# EAGLE design rrsdc (EAGLE 6.4)
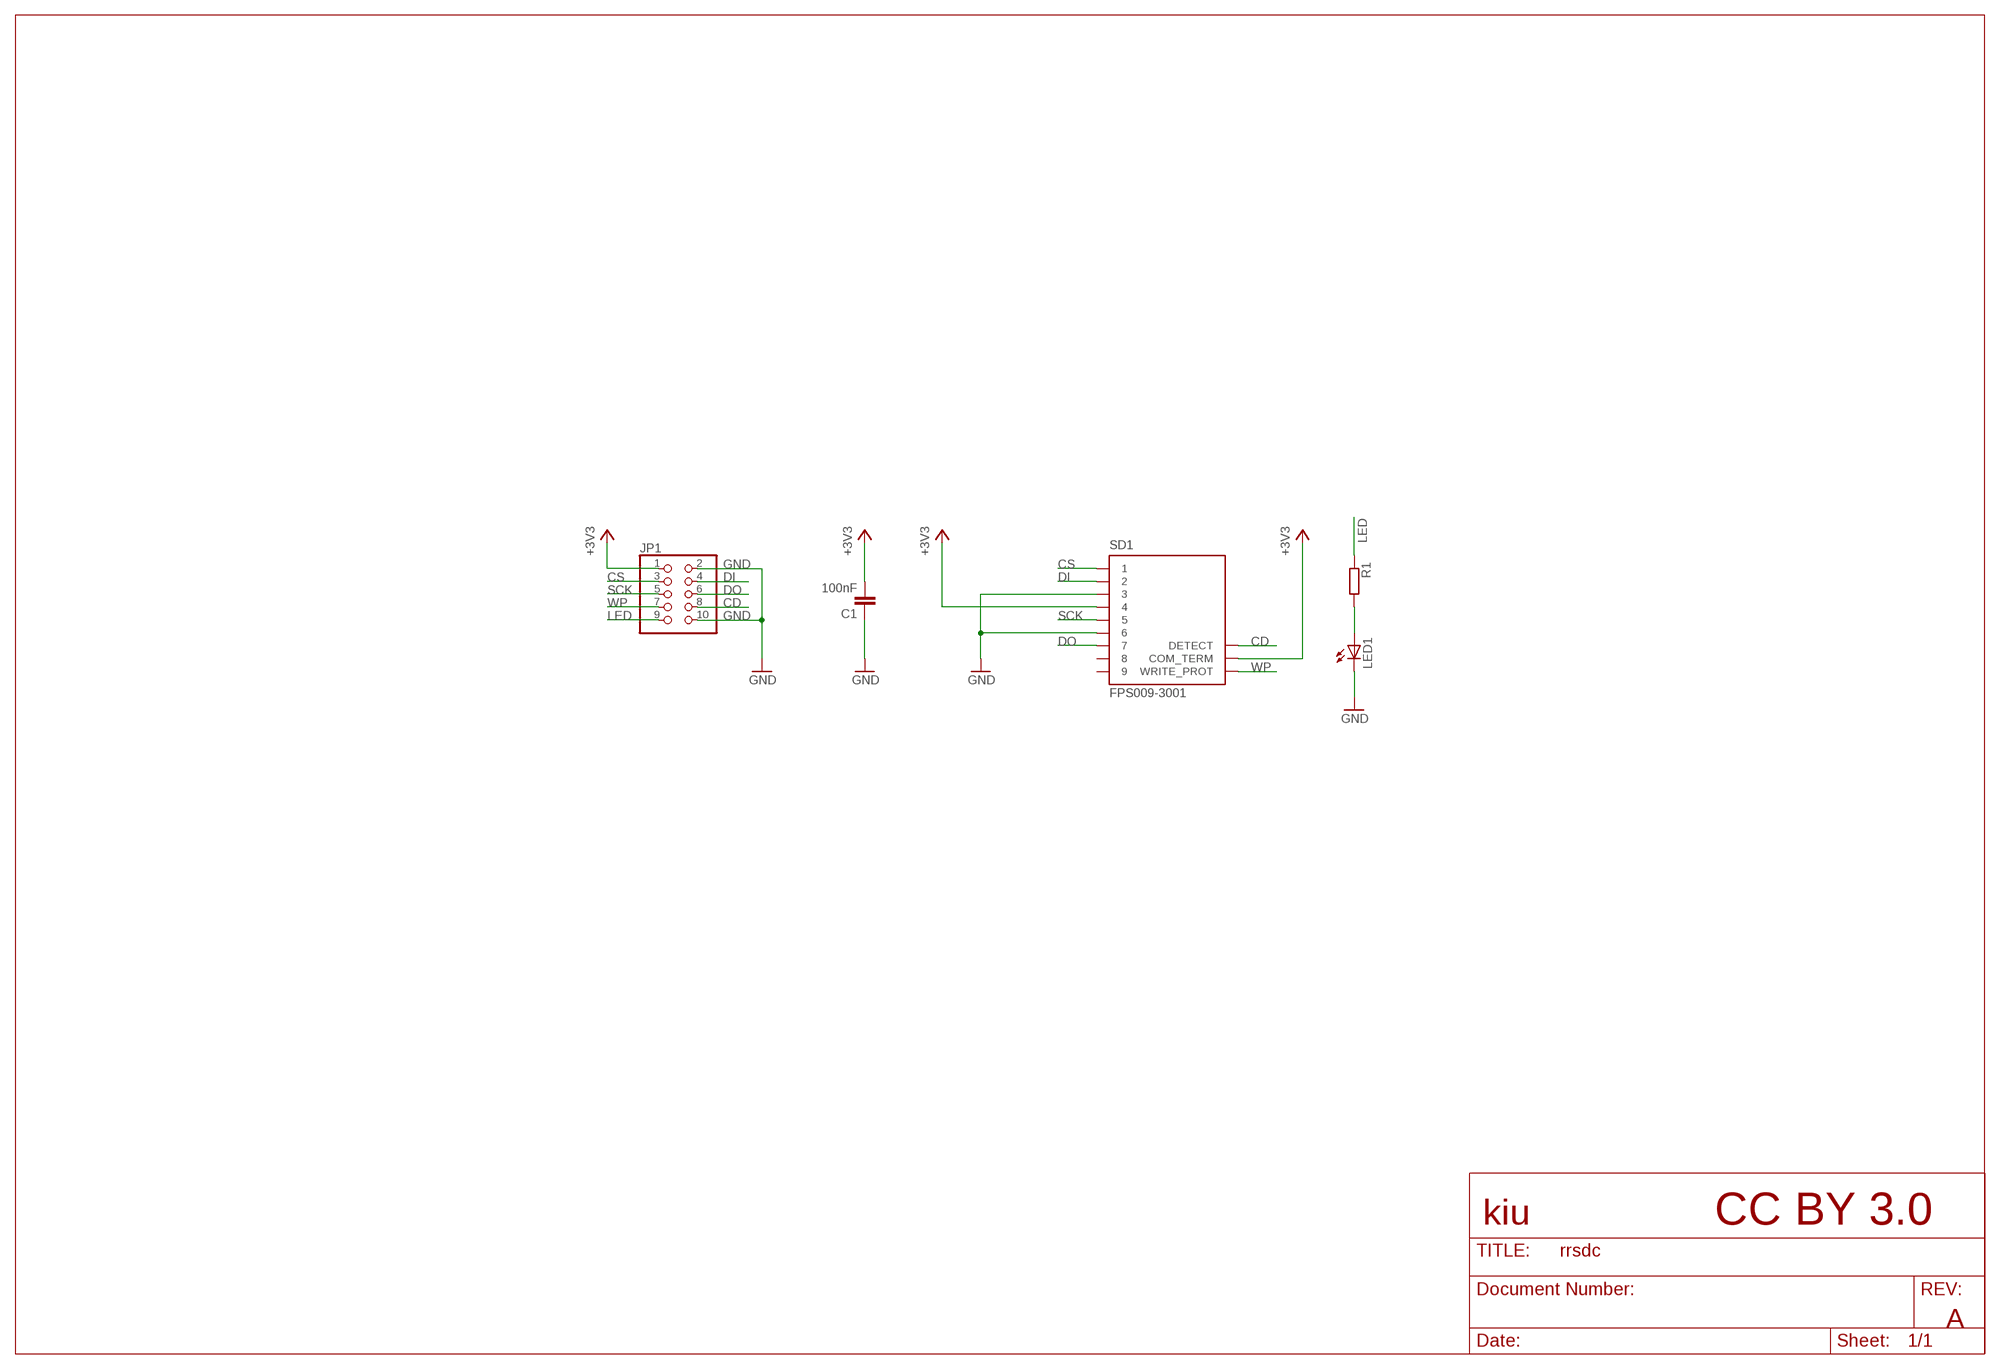
[diagram p0: schematic, sheet 1]

## Parts
C1  100nF  C-EUC0805  [C0805]
JP1  PINHD-2X5  [2X05]
LED1  SIDELEDPLCC-NOTHERM  [PLCC-2-NOTHERM]
R1  R-EU_R0805  [R0805]
SD1  FPS009-3001  [FPS009-3000]

## Nets
+3V3: C1.2 JP1.1 SD1.4 SD1.COM_TERM
CD: JP1.8 SD1.DETECT
CS: JP1.3 SD1.1
DI: JP1.4 SD1.2
DO: JP1.6 SD1.7
GND: C1.1 JP1.2 JP1.10 LED1.C SD1.3 SD1.6
LED: JP1.9 R1.1
N$2: LED1.A R1.2
SCK: JP1.5 SD1.5
WP: JP1.7 SD1.WRITE_PROT
Unconnected: SD1.8 SD1.9

## Notes on the sheet
- kiu | CC BY 3.0
- A

## Library data of the parts
C1 = rcl:C-EU: CAPACITOR, European symbol
JP1 = pinhead:PINHD-2X5: PIN HEADER
LED1 = kiu:SIDELED: Special SIDELED (DO NOT USE)
R1 = rcl:R-EU_: RESISTOR, European symbol
SD1 = con-yamaichi:FPS009-300*: SD Card and MMC Reader (Manual Insertion) Source: http://www.yamaichi.de/pdf/c_fps009_3000.pdf; MPN: FPS009-3001-BL; OC_FARNELL: 1143952; OC_NEWARK: 91K9875

## Board
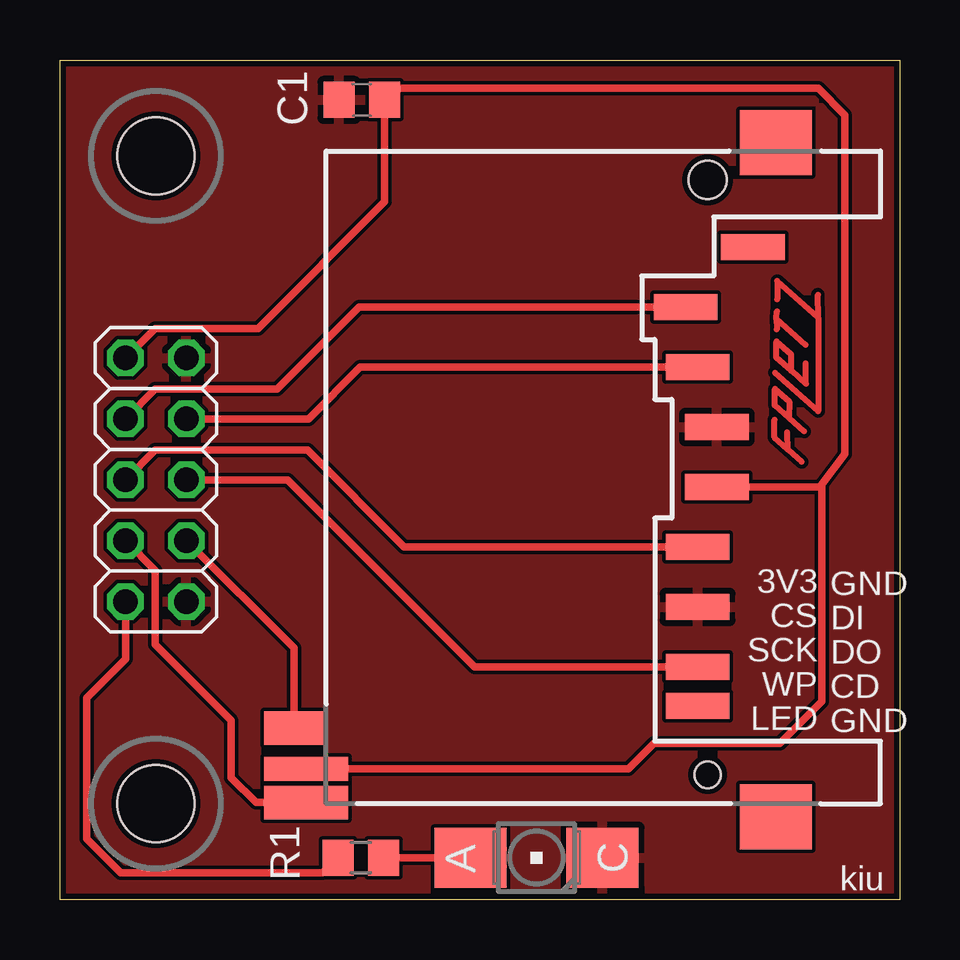
[diagram p1: board, top side]
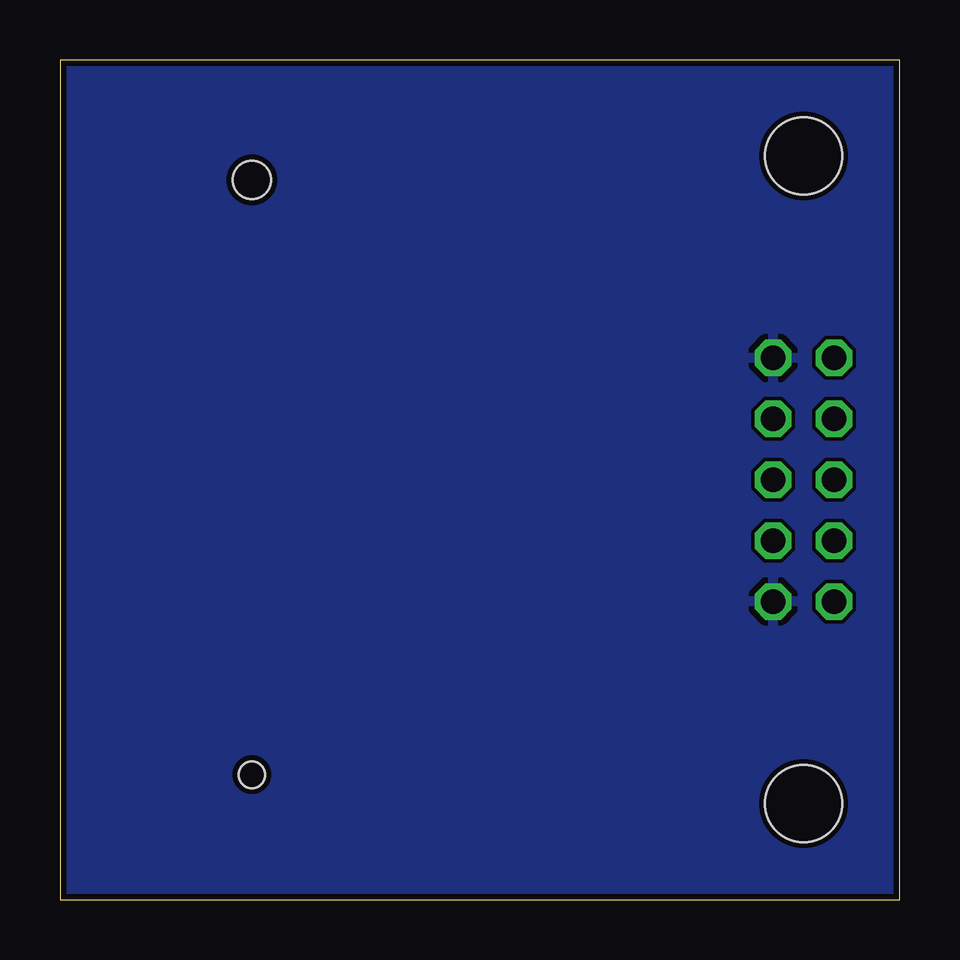
[diagram p2: board, bottom side, seen from below]

Size 35 x 35 mm. Coordinates in mm from the lower left corner, seen from the top.
Outline: 0,0 0,35 35,35 35,0 0,0
Copper layers (1*2*15*16): Top 0.035mm / dielectric 0.2mm / layer 2 0.0175mm / dielectric 1.1mm / layer 15 0.0175mm / dielectric 0.2mm / Bottom 0.035mm
Design rules "SeeedStudio_DRU_no_angle_20130527": minimum track width 6mil, minimum drill 12mil, track to track 6mil, track to pad 6mil, pad to pad 6mil, via to via 6mil, smd to smd 0mil, copper to edge 10mil, drill to drill 10mil, minimum pad ring 6mil, minimum via ring 6mil, stop-mask expansion 2mil, vias tented up to drill 25mil, thermal gap 10mil
Holes 3.2 mm at 4,31 4,4

### Footprints (pad centres in the part's own frame; a part is rotated, then mirrored left to right if it is on the bottom)
C0805 = smd 1.3 x 1.5: 1 -0.95,0; 2 0.95,0
2X05 = drill 1.016 octagon: 1 -5.08,-1.27; 2 -5.08,1.27; 3 -2.54,-1.27; 4 -2.54,1.27; 5 0,-1.27; 6 0,1.27; 7 2.54,-1.27; 8 2.54,1.27; 9 5.08,-1.27; 10 5.08,1.27
PLCC-2-NOTHERM = smd 2.5 x 3: A 0,2.75; C 0,-2.75
R0805 = smd 1.3 x 1.5: 1 -0.95,0; 2 0.95,0
FPS009-3000 = smd 2.65 x 1.1: 1 -0.915,-5.3; 2 -0.415,-7.8; 3 0.385,-10.3; 4 0.385,-12.8; 5 -0.415,-15.3; 6 -0.415,-17.8; 7 -0.415,-20.3; 8 -0.415,-21.925; 9 1.885,-2.8 | smd 3.5 x 1: COM_TERM -16.75,-24.55 | smd 2.5 x 1.4: DETECT -17.25,-22.85 | smd 3 x 2.7: M1 2.85,1.55; M2 2.85,-26.55 | smd 3.5 x 1.4: WRITE_PROT -16.75,-25.95 | hole 1.6: 0,0 | hole 1.1: 0,-24.8

### Placement (x,y rotation side)
C1  12.58,33.33 0 top
JP1  4,17.5 270 top
LED1  19.87,1.75 90 top
R1  12.54,1.75 0 top
SD1  27,30 0 top

### Tracks (layer width: path | path; a pad name or v marks a point on that pad's centre or on a via)
+3V3
  Top 0.305: JP1.1 3.96,23.81 8.26,23.81 13.53,29.09 C1.2 14.17,33.81 31.61,33.81 32.73,32.7 32.73,18.57 31.73,17.28 | SD1.4 31.67,17.2 31.73,17.28 | 31.73,17.28 31.75,17.26 31.75,8.26 30,6.51 24.77,6.51 23.71,5.45 SD1.COM_TERM
CD
  Top 0.305: JP1.8 9.75,10.48 SD1.DETECT
CS
  Top 0.305: JP1.3 3.96,21.27 9.05,21.27 12.48,24.7 SD1.1
DI
  Top 0.305: SD1.2 12.52,22.2 10.36,20.04 JP1.4
DO
  Top 0.305: SD1.7 17.29,9.7 9.49,17.5 JP1.6
GND
  pour Top: -0.5,35.5 35.5,35.5 35.5,-0.5 -0.5,-0.5
  pour Bottom: -0.5,35.5 35.5,35.5 35.5,-0.5 -0.5,-0.5
LED
  Top 0.305: JP1.9 2.73,10.03 1.11,8.41 1.11,2.54 2.54,1.11 10.96,1.11 R1.1
N$2
  Top 0.305: R1.2 LED1.A
N$28
  Top 0.254: 30.41,20.06 29.8,20.61 29.8,21.29 30.42,20.74 30.41,20.06 | 31.03,19.51 30.41,20.06
N$29
  Top 0.254: 29.81,21.96 31.61,20.36 31.61,24.27 | 29.9,25.03 29.9,25.79 31.61,24.27 | 31.61,24.27 31.6,25.21
N$30
  Top 0.254: 31.09,22.35 31.1,21.5 30.48,22.05 | 30.48,22.05 29.86,22.59 29.87,23.27 30.48,22.72 30.48,22.05
N$31
  Top 0.254: 29.79,20 29.79,19.26 30.35,18.75 | 30.35,18.75 30.92,18.25 | 30.35,18.75 30.31,19.47
N$32
  Top 0.254: 29.86,24.21 29.89,23.77 | 31.09,23.12 29.86,24.21 | 29.86,24.21 29.89,24.53
SCK
  Top 0.305: JP1.5 3.96,18.73 10.32,18.73 14.35,14.7 SD1.5
WP
  Top 0.305: SD1.WRITE_PROT 8.17,4.05 7.14,5.08 7.14,7.46 3.97,10.64 3.97,13.72 JP1.7

### Text on the board
tNames: GND | 3V3 | DI | CS | DO | SCK | CD | WP | GND | LED | kiu
tDocu: RRSDC REV A